# EAGLE schematic PowerBoard (EAGLE 6.1)
AUTHOR: Sandor Szilvasi; AUTHOREMAIL: sandor.szilvasi@vanderbilt.edu; COPYRIGHT: Copyright © 2011 Vanderbilt University, ISIS; PAGE1: Cover Page; PAGE2: Power Supply; PAGE3: Current Monitor; PAGE4: Misc; PAGE5: Connector; REVIEWER: Benjamin Babjak; REVIEWEREMAIL: benjamin.babjak@vanderbilt.edu; REVISION: B; TITLE: Yellowstone

## Sheet 1 of 5
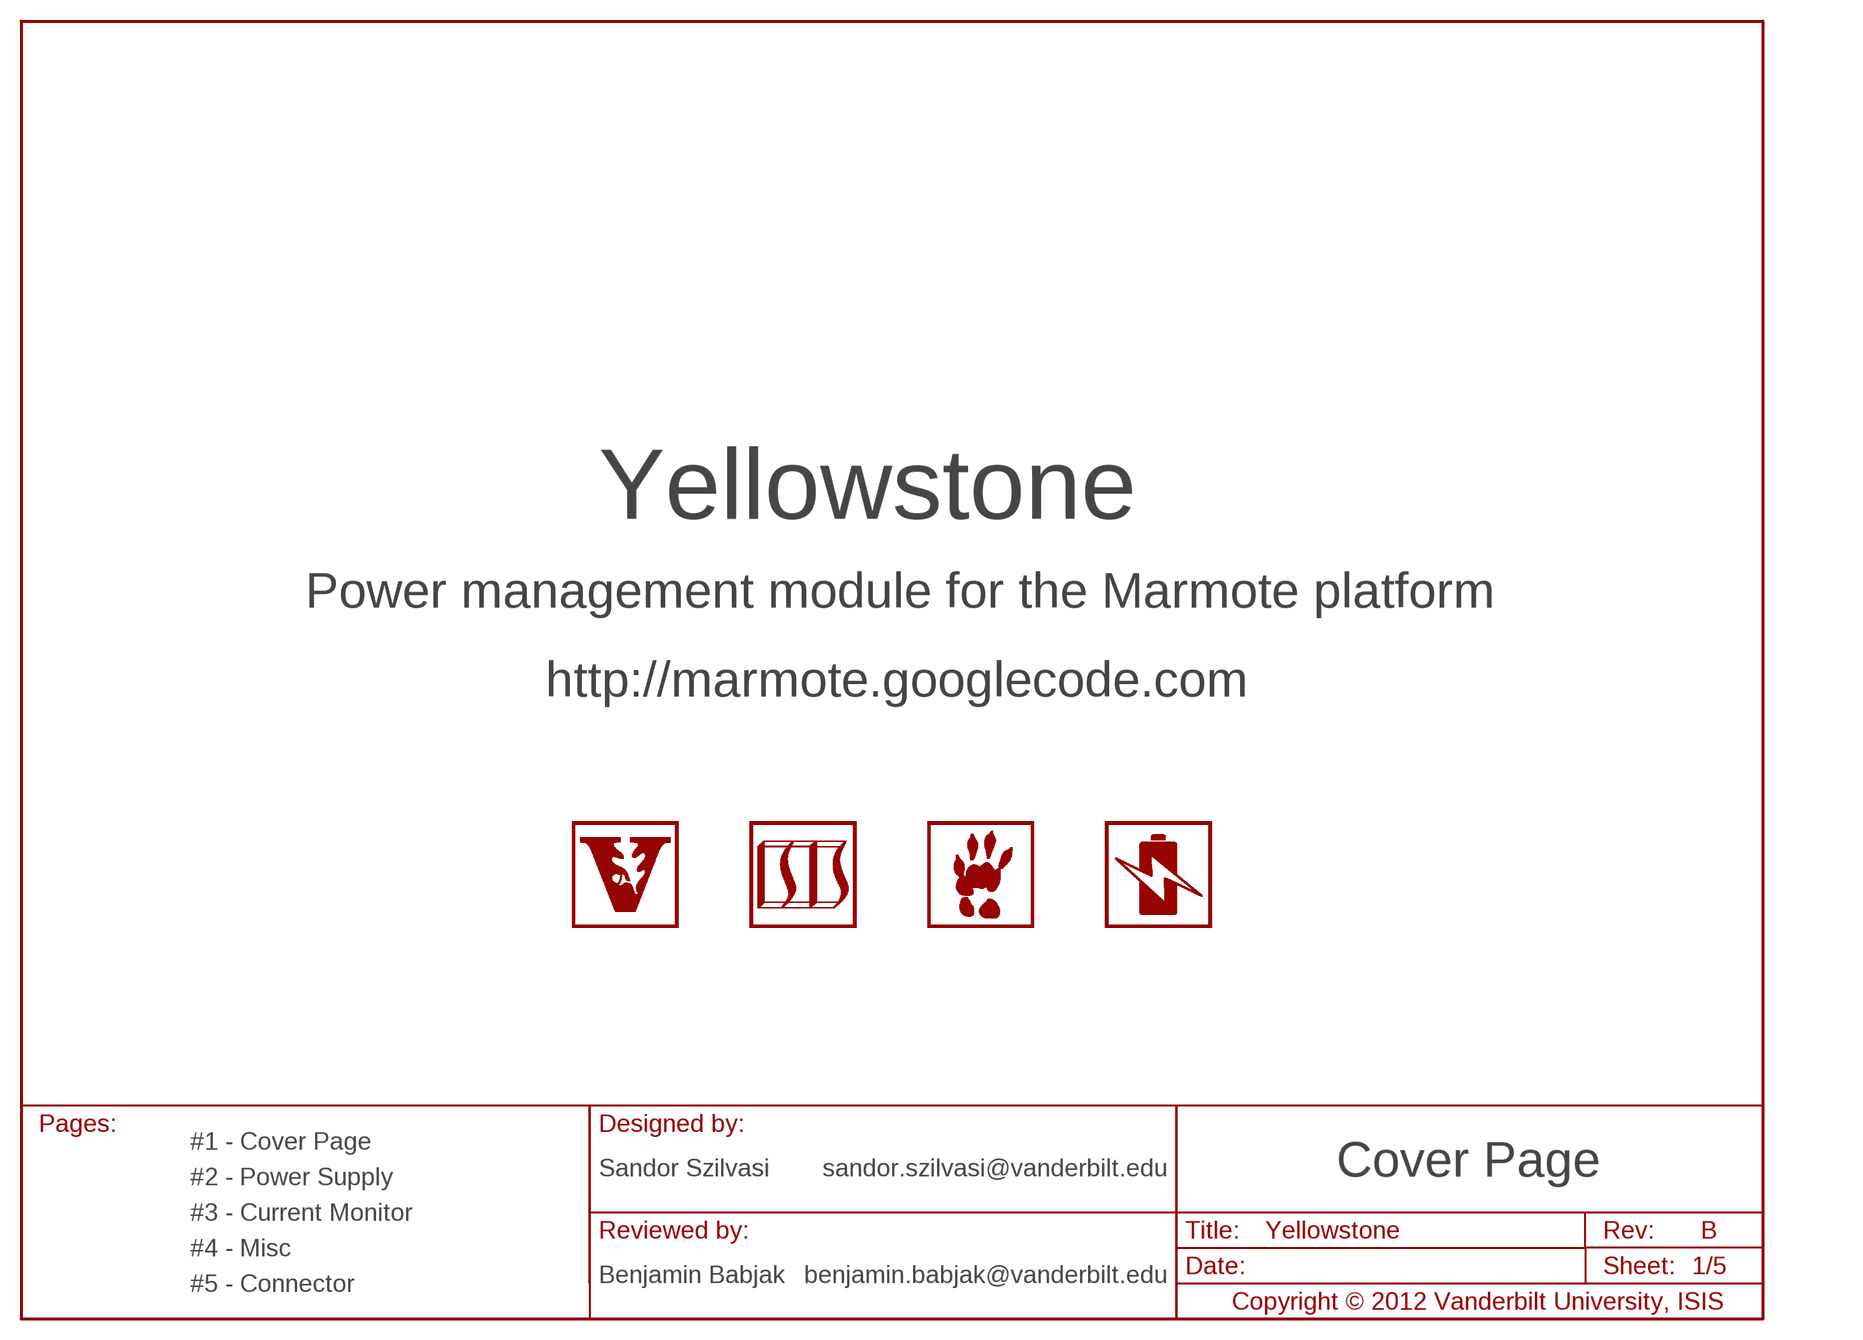
[diagram p0: schematic, sheet 1]

### Parts
LOGO1  LOGO-ISIS-600MIL-10MM-SS  [LOGO-ISIS-10MM-SILKSCREEN]
LOGO2  LOGO-BATTERY-600MIL-10MM-SS  [LOGO-BATTERY-10MM-SILKSCREEN]
LOGO5  LOGO-VANDERBILT-600MIL-10MM-SS  [LOGO-VANDERBILT-10MM-SILKSCREEN]
LOGO6  LOGO-MARMOTE-600MIL-10MM-SS  [LOGO-MARMOTE-10MM-SILKSCREEN]

### Notes on the sheet
- Power management module for the Marmote platform
- http://marmote.googlecode.com

## Sheet 2 of 5
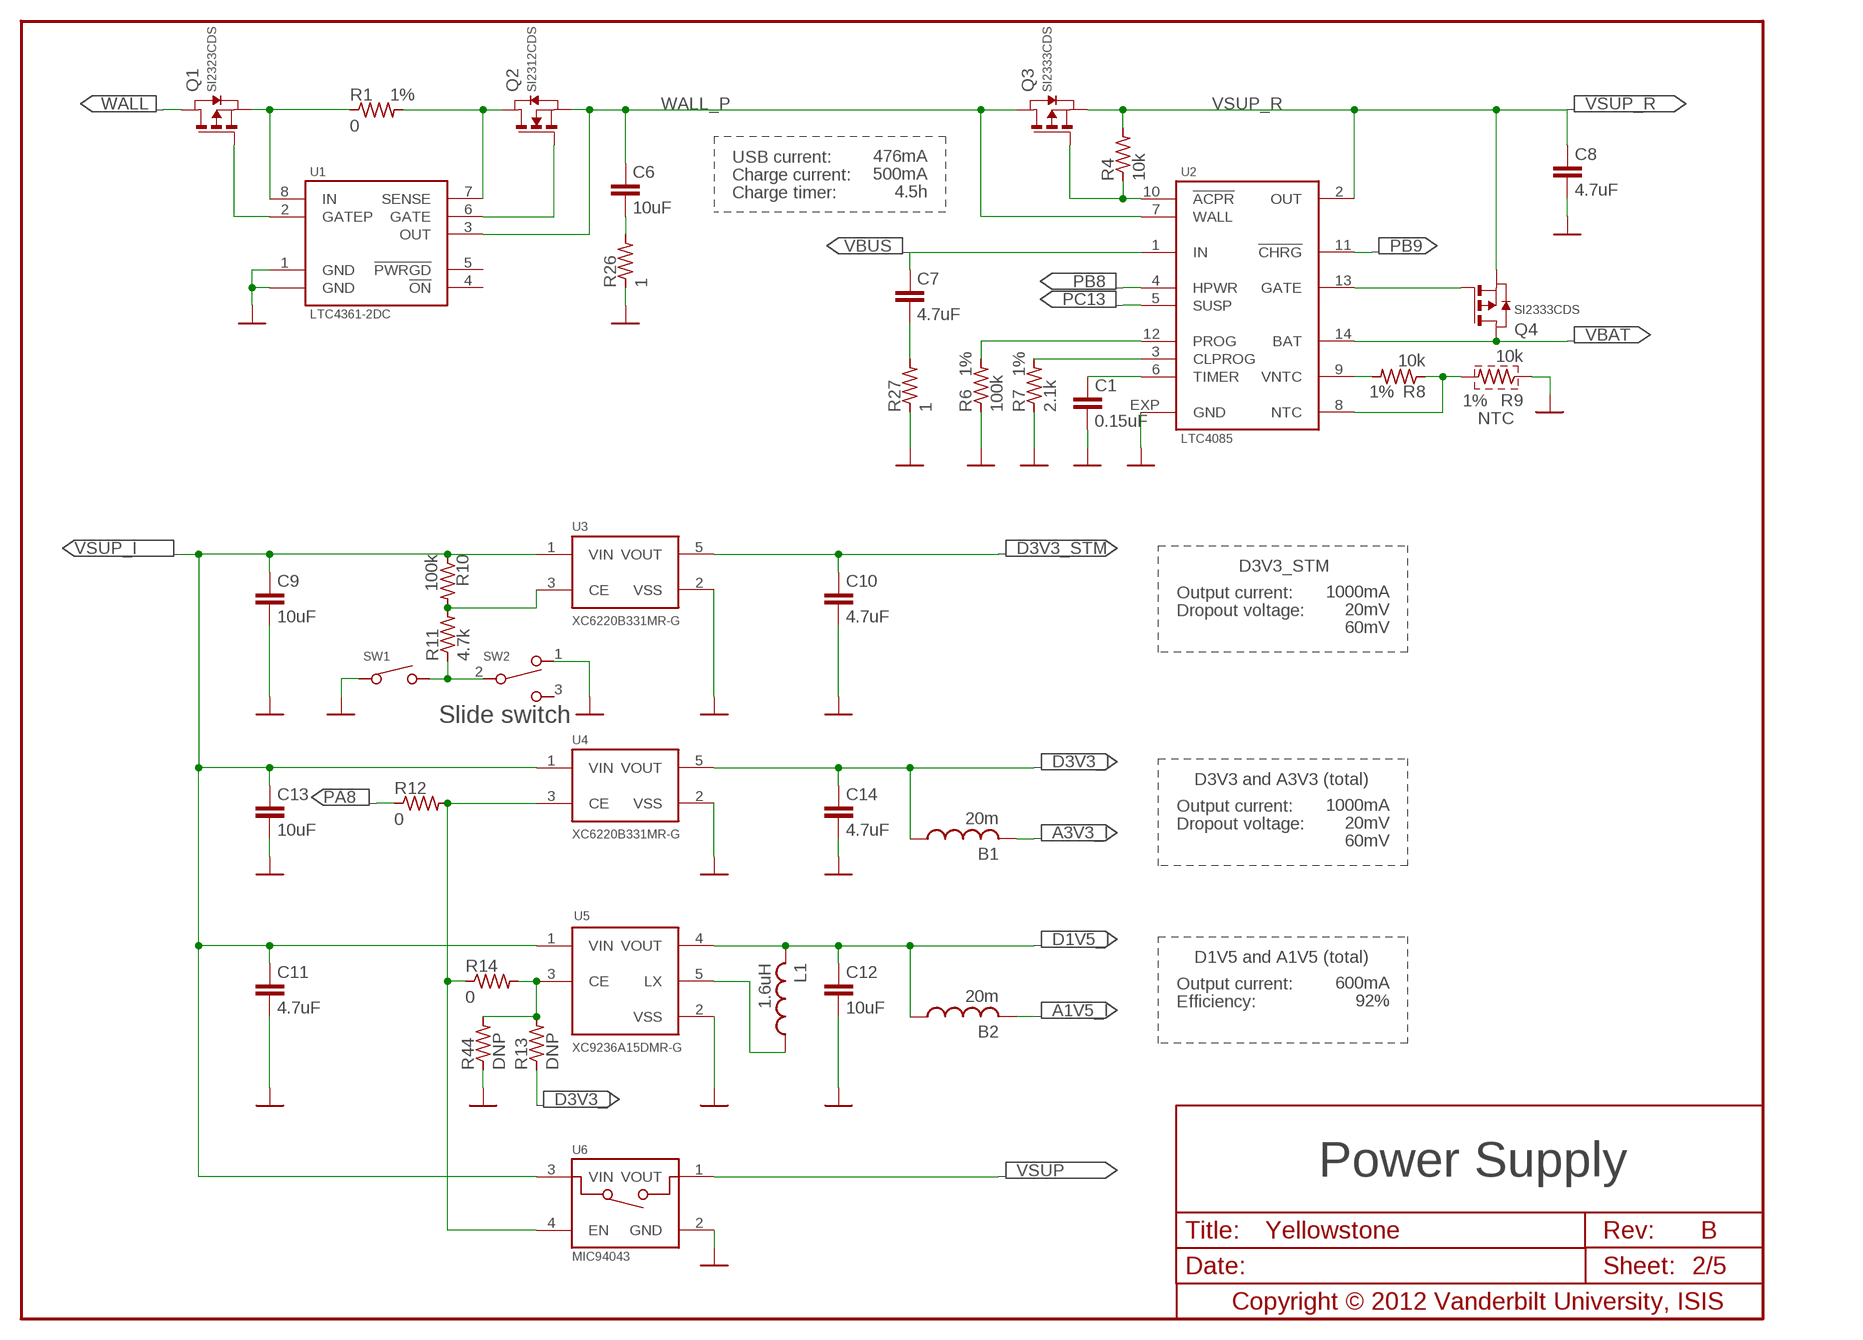
[diagram p1: schematic, sheet 2]

### Parts
B1  20m  BEAD0603  [L0603]
B2  20m  BEAD0603  [L0603]
C1  0.15uF  C0603  [C0603]
C6  10uF  C0603  [C0603]
C7  4.7uF  C0603  [C0603]
C8  4.7uF  C0603  [C0603]
C9  10uF  C0603  [C0603]
C10  4.7uF  C0603  [C0603]
C11  4.7uF  C0603  [C0603]
C12  10uF  C0603  [C0603]
C13  10uF  C0603  [C0603]
C14  4.7uF  C0603  [C0603]
L1  1.6uH  L-VLCF4018T  [4X4MM]
Q1  SI2323CDS  [SOT23-3L]
Q2  SI2312CDS  [SOT23-3L]
Q3  SI2333CDS  [SOT23-3L]
Q4  SI2333CDS  [SOT23-3L]
R1  0  R0603  [R0603]
R4  10k  R0603  [R0603]
R6  100k  R0603  [R0603]
R7  2.1k  R0603  [R0603]
R8  10k  R0603  [R0603]
R9  10k  NTCG06  [R0603]
R10  100k  R0603  [R0603]
R11  4.7k  R0603  [R0603]
R12  0  R0603  [R0603]
R13  DNP  R0603  [R0603]
R14  0  R0603  [R0603]
R26  1  R0603  [R0603]
R27  1  R0603  [R0603]
R44  DNP  R0603  [R0603]
SW1  SWITCH-SPST  SWITCH-SPST-JST  [S2B-PH-SM4-TB]
SW2  SWITCH-MS12ASG30  [MS12ASX30]
U1  LTC4361-2DC  [DFN-8]
U2  LTC4085  [DFN-14]
U3  XC6220B331MR-G  [SOT25]
U4  XC6220B331MR-G  [SOT25]
U5  XC9236A15DMR-G  [SOT25]
U6  MIC94043  [MLF-4]

### Nets
!ACPR: Q3.1(G) R4.1 U2.10(!ACPR)
A1V5_I: B2.2 ; also sheet 3
A3V3_I: B1.2 ; also sheet 3
CLPROG: R7.2 U2.3(CLPROG)
D1V5-EN: R13.2 R14.2 R44.2 U5.3(CE)
D1V5_I: B2.1 C12.1 L1.2 U5.4(VOUT) ; also sheet 3
D3V3_I: B1.1 C14.1 R13.1 U4.5(VOUT) ; also sheet 3
D3V3_STM: C10.1 U3.5(VOUT) ; also sheet 3,4,5
D3V3_STM-EN: R10.2 R11.2 U3.3(CE)
D3V3_STM-EN-SW: R11.1 SW1.2(1A) SW2.2
DGND: C1.2 C8.2 C9.2 C10.2 C11.2 C12.2 C13.2 C14.2 R6.1 R7.1 R9.2 R26.1 R27.1 R44.1 SW1.1 SW2.1 U1.1(GND) U1.EXP(GND) U2.EXP(GND) U3.2(VSS) U4.2(VSS) U5.2(VSS) U6.2(GND) ; also sheet 3,4,5
GATE1: Q2.1(G) U1.6(GATE)
GATE2: Q4.1(G) U2.13(GATE)
GATEP: Q1.1(G) U1.2(GATEP)
IN: Q1.2(S) R1.1 U1.8(IN)
N$1: C7.2 R27.2
N$3: C6.2 R26.2
N$5: L1.1 U5.5(LX)
N$15: Q2.3(D) R1.2 U1.7(SENSE)
NTC: R8.1 R9.1 U2.8(NTC)
PA8: R12.1 ; also sheet 3,4
PA8-EN: R12.2 R14.1 U4.3(CE) U6.4(EN) ; also sheet 4
PB8: U2.4(HPWR) ; also sheet 3,4
PB9: U2.11(!CHRG) ; also sheet 3,4
PC13: U2.5(SUSP) ; also sheet 3,4
PROG: R6.2 U2.12(PROG)
TIMER: C1.1 U2.6(TIMER)
VBAT: Q4.3(D) U2.14(BAT) ; also sheet 3,4
VBUS: C7.1 U2.1(IN) ; also sheet 4,5
VNTC: R8.2 U2.9(VNTC)
VSUP: U6.1(VOUT) ; also sheet 4,5
VSUP_I: C9.1 C11.1 C13.1 R10.1 U3.1(VIN) U4.1(VIN) U5.1(VIN) U6.3(VIN) ; also sheet 3
VSUP_R: C8.1 Q3.2(S) Q4.2(S) R4.2 U2.2(OUT) ; also sheet 3,4
WALL: Q1.3(D) ; also sheet 4,5
WALL_P: C6.1 Q2.2(S) Q3.3(D) U1.3(OUT) U2.7(WALL)
Unconnected: SW2.3 U1.4(!ON) U1.5(!PWRGD) U3.4(NC) U4.4(NC)

### Notes on the sheet
- 476mA
- USB current: | 500mA
- Charge current: | 4.5h
- Charge timer:
- D3V3_STM
- 1000mA
- Output current: | 20mV
- Dropout voltage: | 60mV
- Slide switch
- D3V3 and A3V3 (total)
- 1000mA
- Output current: | 20mV
- Dropout voltage: | 60mV
- D1V5 and A1V5 (total)
- 600mA
- Output current: | 92%
- Efficiency:

## Sheet 3 of 5
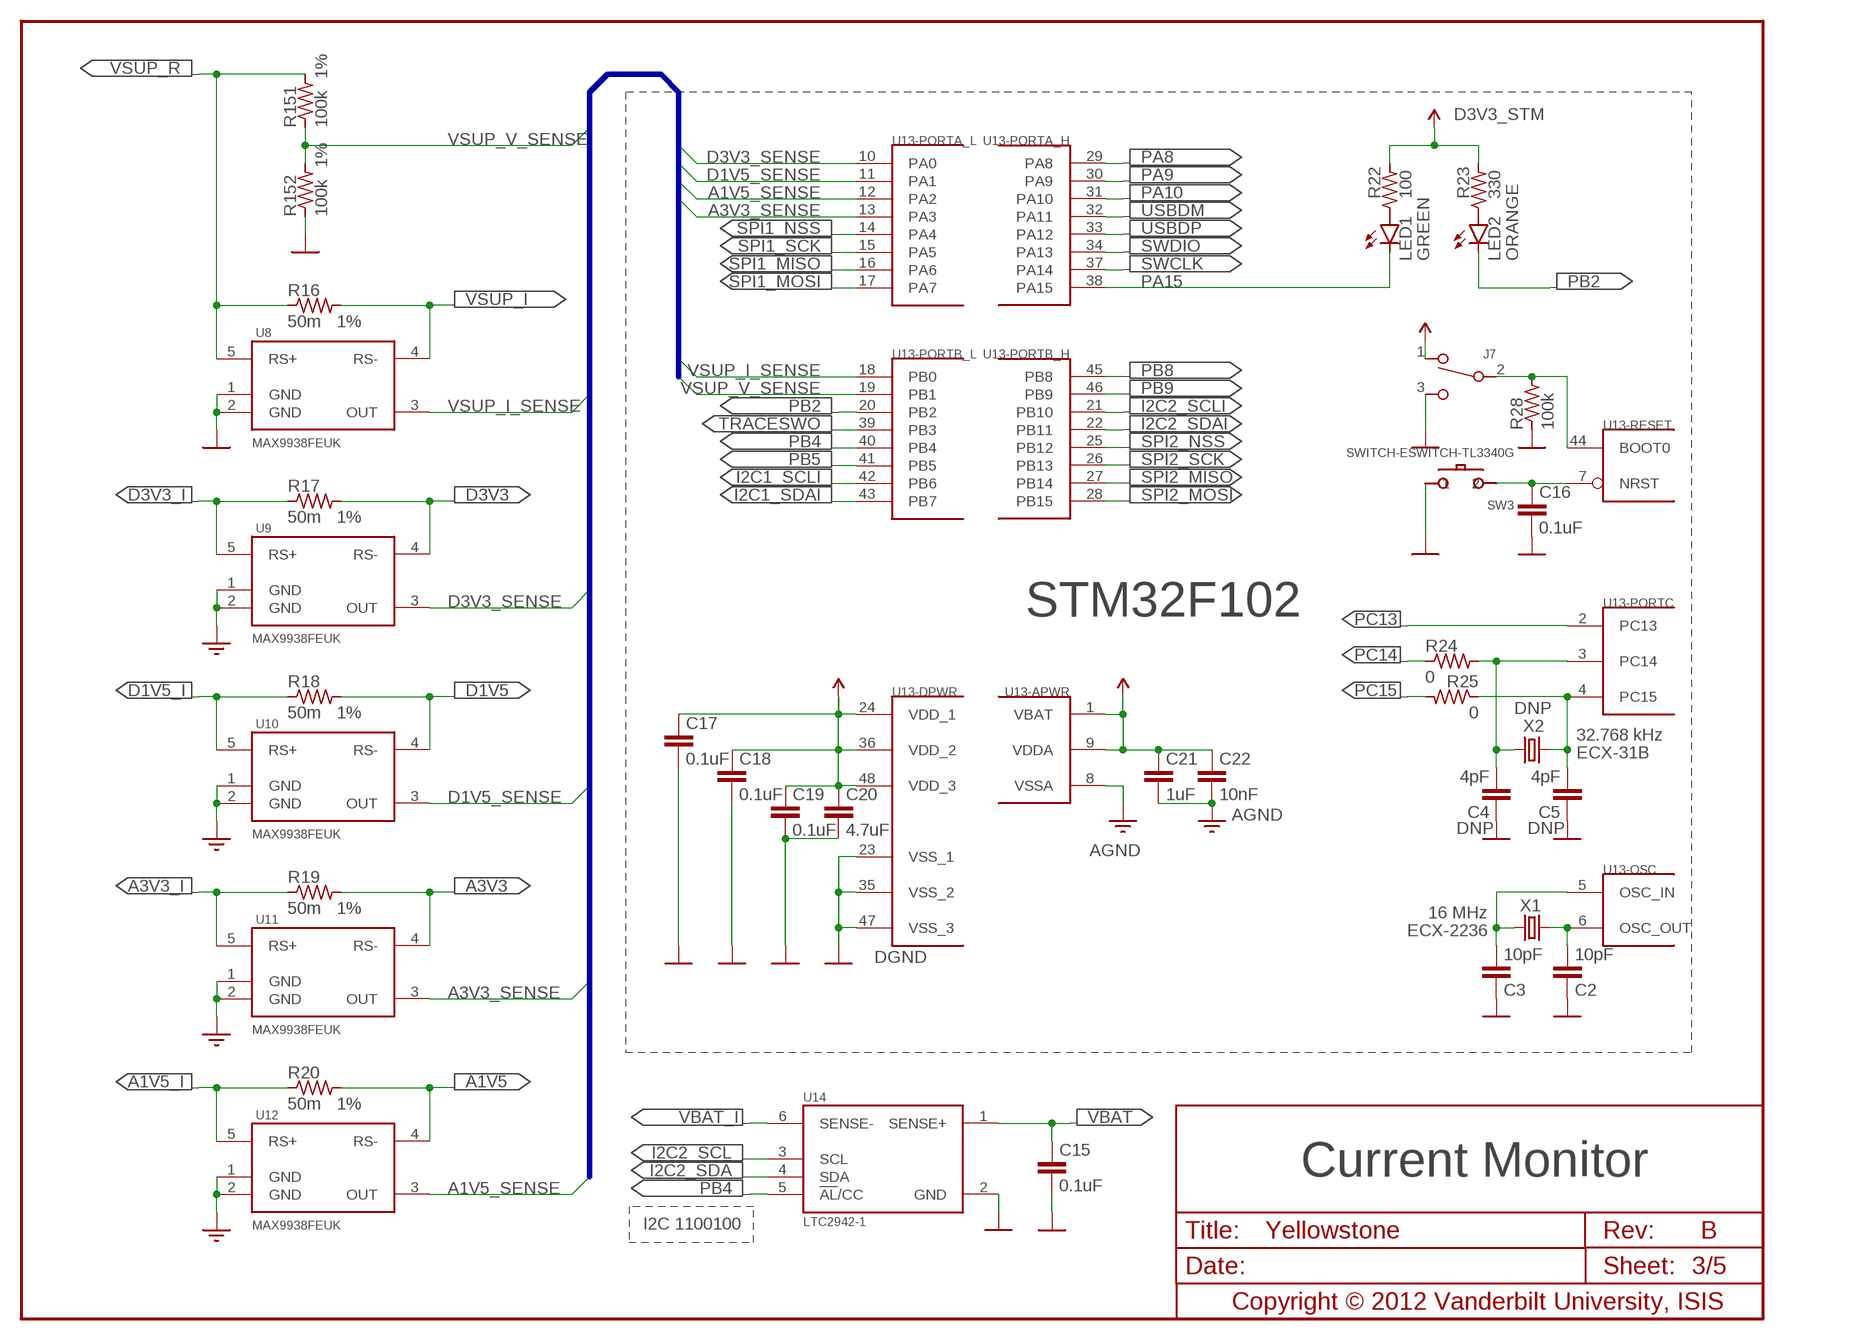
[diagram p2: schematic, sheet 3]

### Parts
C2  10pF  C0603  [C0603]
C3  10pF  C0603  [C0603]
C4  4pF  C0603  [C0603]
C5  4pF  C0603  [C0603]
C15  0.1uF  C0603  [C0603]
C16  0.1uF  C0603  [C0603]
C17  0.1uF  C0603  [C0603]
C18  0.1uF  C0603  [C0603]
C19  0.1uF  C0603  [C0603]
C20  4.7uF  C0603  [C0603]
C21  1uF  C0603  [C0603]
C22  10nF  C0603  [C0603]
J7  SWITCH-CJS-1200-1200  [SWITCH-DIP-CJS]
LED1  GREEN  LED-MGC-3010  [LED1208-RA]
LED2  ORANGE  LED-ECK-3010  [LED1208-RA]
R16  50m  R0603  [R0603]
R17  50m  R0603  [R0603]
R18  50m  R0603  [R0603]
R19  50m  R0603  [R0603]
R20  50m  R0603  [R0603]
R22  100  R0603  [R0603]
R23  330  R0603  [R0603]
R24  0  R0603  [R0603]
R25  0  R0603  [R0603]
R28  100k  R0603  [R0603]
R151  100k  R0603  [R0603]
R152  100k  R0603  [R0603]
SW3  SWITCH-ESWITCH-TL3340G  [TL3340]
U8  MAX9938FEUK  [SOT23-5L]
U9  MAX9938FEUK  [SOT23-5L]
U10  MAX9938FEUK  [SOT23-5L]
U11  MAX9938FEUK  [SOT23-5L]
U12  MAX9938FEUK  [SOT23-5L]
U13  STM32F10XCXT6  [TQFP-48]
U14  LTC2942-1  [DFN-6]
X1  ECX-2236  [ECX-2236]
X2  ECX-31B  [ECX-31B]

### Nets
A1V5: R20.2 U12.4(RS-) ; also sheet 4,5
A1V5_I: R20.1 U12.5(RS+) ; also sheet 2
A1V5_SENSE: U12.3(OUT) U13.12(-PORTA_L:PA2)
A3V3: R19.2 U11.4(RS-) ; also sheet 4,5
A3V3_I: R19.1 U11.5(RS+) ; also sheet 2
A3V3_SENSE: U11.3(OUT) U13.13(-PORTA_L:PA3)
AGND: C21.2 C22.2 U9.1(GND) U9.2(GND) U10.1(GND) U10.2(GND) U11.1(GND) U11.2(GND) U12.1(GND) U12.2(GND) U13.8(-APWR:VSSA) ; also sheet 4,5
BOOT0: J7.2 R28.2 U13.44(-RESET:BOOT0)
D1V5: R18.2 U10.4(RS-) ; also sheet 4,5
D1V5_I: R18.1 U10.5(RS+) ; also sheet 2
D1V5_SENSE: U10.3(OUT) U13.11(-PORTA_L:PA1)
D3V3: R17.2 U9.4(RS-) ; also sheet 4,5
D3V3_I: R17.1 U9.5(RS+) ; also sheet 2
D3V3_SENSE: U9.3(OUT) U13.10(-PORTA_L:PA0)
D3V3_STM: C17.1 C18.1 C19.1 C20.1 C21.1 C22.1 J7.1 R22.2 R23.2 U13.1(-APWR:VBAT) U13.9(-APWR:VDDA) U13.24(-DPWR:VDD_1) U13.36(-DPWR:VDD_2) U13.48(-DPWR:VDD_3) ; also sheet 2,4,5
DGND: C2.1 C3.1 C4.1 C5.1 C15.2 C16.2 C17.2 C18.2 C19.2 C20.2 J7.3 R28.1 R152.1 SW3.1 SW3.3 U8.1(GND) U8.2(GND) U13.23(-DPWR:VSS_1) U13.35(-DPWR:VSS_2) U13.47(-DPWR:VSS_3) U14.2(GND) ; also sheet 2,4,5
I2C1_SCLI: U13.42(-PORTB_L:PB6) ; also sheet 4
I2C1_SDAI: U13.43(-PORTB_L:PB7) ; also sheet 4
I2C2_SCL: U14.3(SCL) ; also sheet 4
I2C2_SCLI: U13.21(-PORTB_H:PB10) ; also sheet 4
I2C2_SDA: U14.4(SDA) ; also sheet 4
I2C2_SDAI: U13.22(-PORTB_H:PB11) ; also sheet 4
N$25: LED2.2(A) R23.1
N$29: LED1.2(A) R22.1
NRST: C16.1 SW3.2 U13.7(-RESET:NRST)
OSC_IN: C3.2 U13.5(-OSC:OSC_IN) X1.3
OSC_OUT: C2.2 U13.6(-OSC:OSC_OUT) X1.1
PA8: U13.29(-PORTA_H:PA8) ; also sheet 2,4
PA9: U13.30(-PORTA_H:PA9) ; also sheet 5
PA10: U13.31(-PORTA_H:PA10) ; also sheet 5
PA15: LED1.1(C) U13.38(-PORTA_H:PA15)
PB2: LED2.1(C) U13.20(-PORTB_L:PB2) ; also sheet 4
PB4: U13.40(-PORTB_L:PB4) U14.5(!AL!/CC) ; also sheet 4
PB5: U13.41(-PORTB_L:PB5) ; also sheet 5
PB8: U13.45(-PORTB_H:PB8) ; also sheet 2,4
PB9: U13.46(-PORTB_H:PB9) ; also sheet 2,4
PC13: U13.2(-PORTC:PC13) ; also sheet 2,4
PC14: R24.1 ; also sheet 5
PC14-S: C4.2 R24.2 U13.3(-PORTC:PC14) X2.2
PC15: R25.2 ; also sheet 5
PC15-S: C5.2 R25.1 U13.4(-PORTC:PC15) X2.1
SPI1_MISO: U13.16(-PORTA_L:PA6) ; also sheet 5
SPI1_MOSI: U13.17(-PORTA_L:PA7) ; also sheet 5
SPI1_NSS: U13.14(-PORTA_L:PA4) ; also sheet 4,5
SPI1_SCK: U13.15(-PORTA_L:PA5) ; also sheet 5
SPI2_MISO: U13.27(-PORTB_H:PB14) ; also sheet 5
SPI2_MOSI: U13.28(-PORTB_H:PB15) ; also sheet 5
SPI2_NSS: U13.25(-PORTB_H:PB12) ; also sheet 4,5
SPI2_SCK: U13.26(-PORTB_H:PB13) ; also sheet 5
SWCLK: U13.37(-PORTA_H:PA14) ; also sheet 5
SWDIO: U13.34(-PORTA_H:PA13) ; also sheet 5
TRACESWO: U13.39(-PORTB_L:PB3) ; also sheet 5
USBDM: U13.32(-PORTA_H:PA11) ; also sheet 5
USBDP: U13.33(-PORTA_H:PA12) ; also sheet 5
VBAT: C15.1 U14.1(SENSE+) ; also sheet 2,4
VBAT_I: U14.6(SENSE-) ; also sheet 5
VSUP_I: R16.2 U8.4(RS-) ; also sheet 2
VSUP_I_SENSE: U8.3(OUT) U13.18(-PORTB_L:PB0)
VSUP_R: R16.1 R151.2 U8.5(RS+) ; also sheet 2,4
VSUP_V_SENSE: R151.1 R152.2 U13.19(-PORTB_L:PB1)

### Buses
D3V3_STM_SENSE,VSUP_SENSE,D3V3_SENSE,D1V5_SENSE,A3V3_SENSE,A1V5_SENSE

### Notes on the sheet
- STM32F102
- 32.768 kHz
- 16 MHz
- I2C 1100100

## Sheet 4 of 5
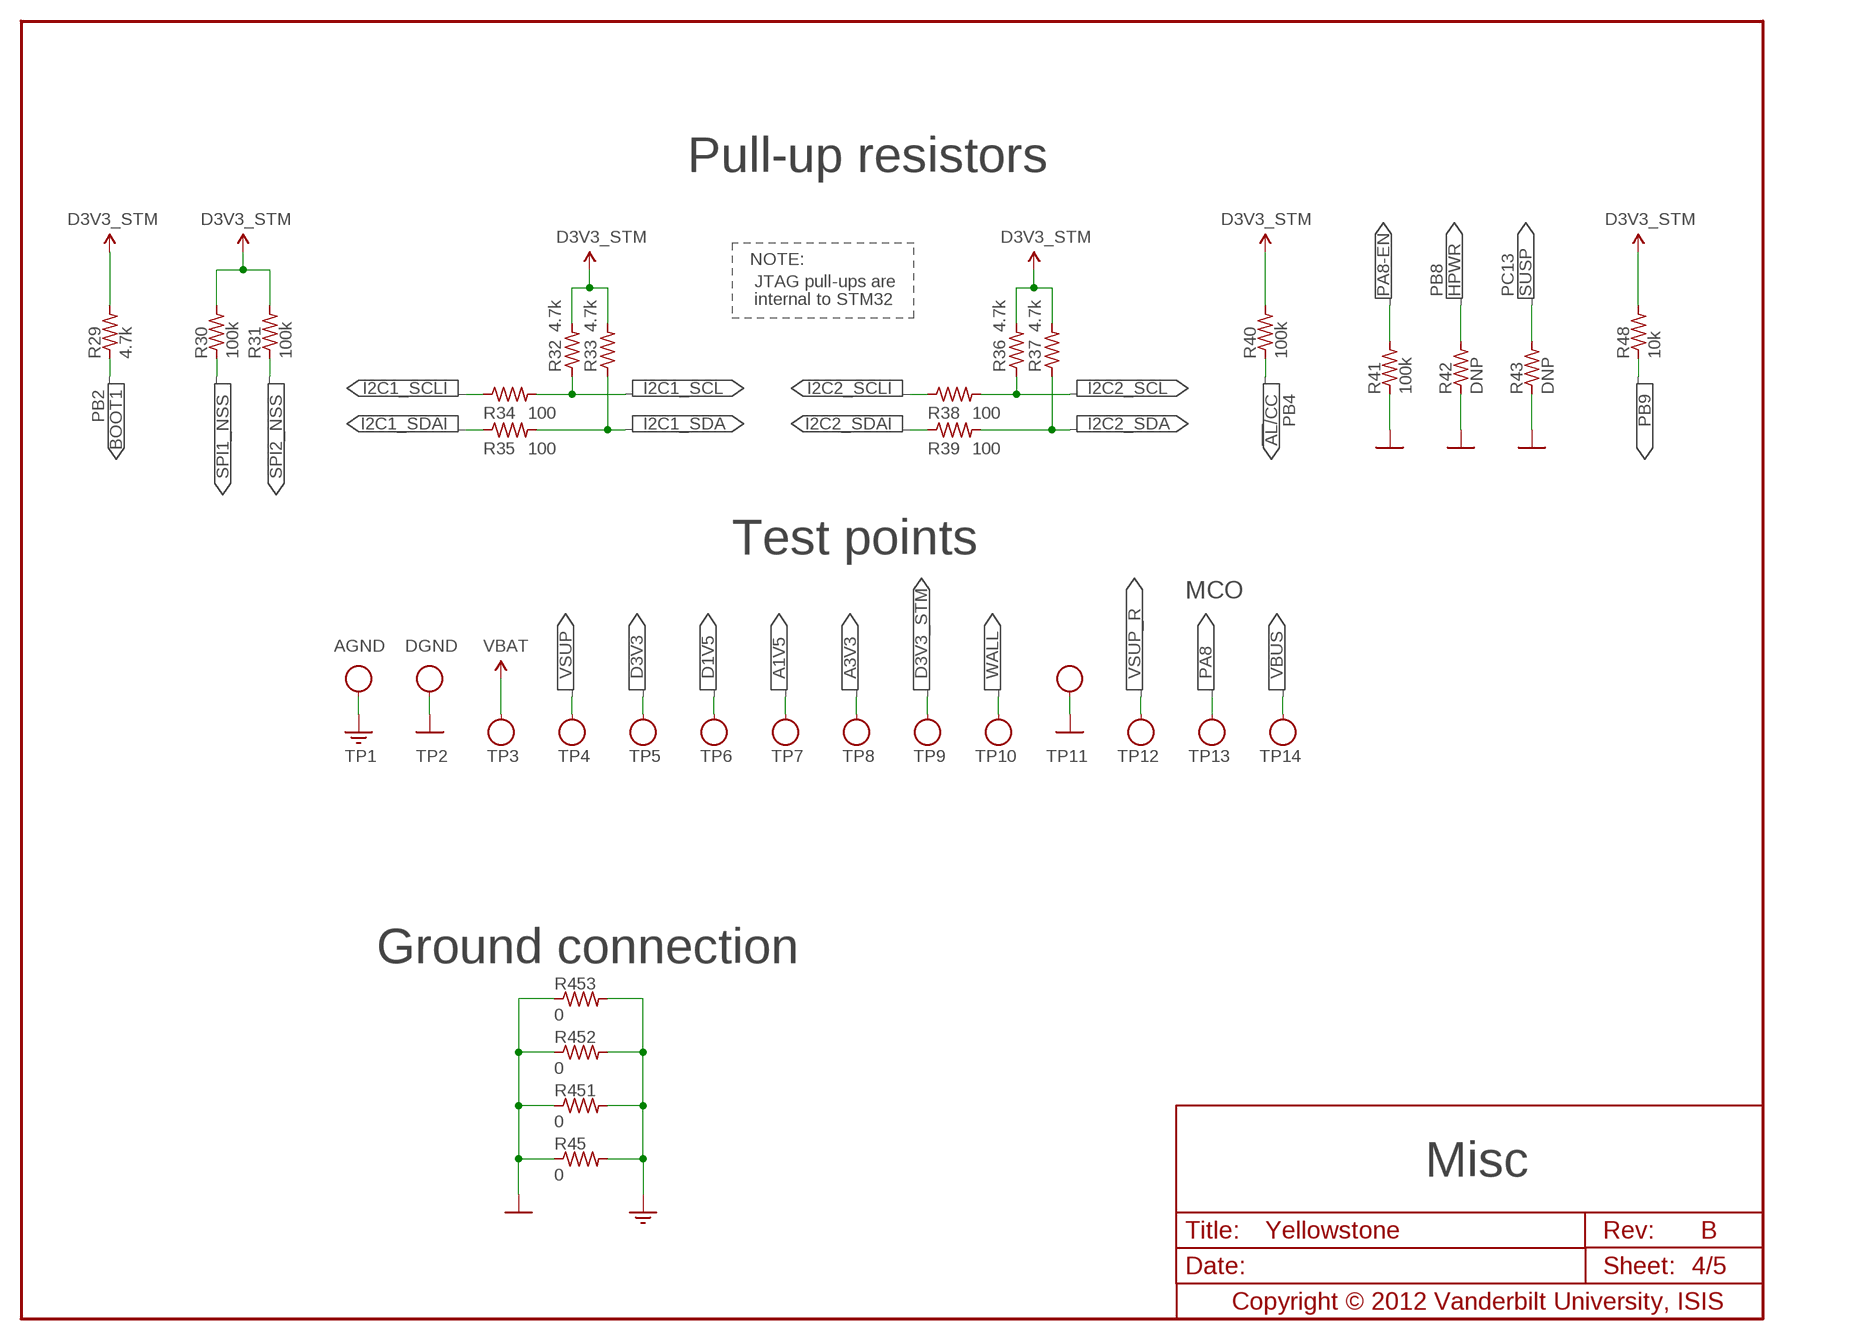
[diagram p3: schematic, sheet 4]

### Parts
R29  4.7k  R0603  [R0603]
R30  100k  R0603  [R0603]
R31  100k  R0603  [R0603]
R32  4.7k  R0603  [R0603]
R33  4.7k  R0603  [R0603]
R34  100  R0603  [R0603]
R35  100  R0603  [R0603]
R36  4.7k  R0603  [R0603]
R37  4.7k  R0603  [R0603]
R38  100  R0603  [R0603]
R39  100  R0603  [R0603]
R40  100k  R0603  [R0603]
R41  100k  R0603  [R0603]
R42  DNP  R0603  [R0603]
R43  DNP  R0603  [R0603]
R45  0  R0603  [R0603]
R48  10k  R0603  [R0603]
R451  0  R0603  [R0603]
R452  0  R0603  [R0603]
R453  0  R0603  [R0603]
TP1  TESTPOINT  TESTPOINT-YELLOW  [TESTPOINT]
TP2  TESTPOINT  TESTPOINT-YELLOW  [TESTPOINT]
TP3  TESTPOINT  TESTPOINT-BLUE  [TESTPOINT]
TP4  TESTPOINT  TESTPOINT-BLUE  [TESTPOINT]
TP5  TESTPOINT  TESTPOINT-BLUE  [TESTPOINT]
TP6  TESTPOINT  TESTPOINT-BLUE  [TESTPOINT]
TP7  TESTPOINT  TESTPOINT-GREEN  [TESTPOINT]
TP8  TESTPOINT  TESTPOINT-GREEN  [TESTPOINT]
TP9  TESTPOINT  TESTPOINT-BLUE  [TESTPOINT]
TP10  TESTPOINT  TESTPOINT-BLUE  [TESTPOINT]
TP11  TESTPOINT  TESTPOINT-YELLOW  [TESTPOINT]
TP12  TESTPOINT  TESTPOINT-BLUE  [TESTPOINT]
TP13  TESTPOINT  TESTPOINT-RED  [TESTPOINT]
TP14  TESTPOINT  TESTPOINT-BLUE  [TESTPOINT]

### Nets
A1V5: TP7.1 ; also sheet 3,5
A3V3: TP8.1 ; also sheet 3,5
AGND: R45.2 R451.2 R452.2 R453.2 TP1.1 ; also sheet 3,5
D1V5: TP6.1 ; also sheet 3,5
D3V3: TP5.1 ; also sheet 3,5
D3V3_STM: R29.2 R30.2 R31.2 R32.2 R33.2 R36.2 R37.2 R40.2 R48.2 TP9.1 ; also sheet 2,3,5
DGND: R41.1 R42.1 R43.1 R45.1 R451.1 R452.1 R453.1 TP2.1 TP11.1 ; also sheet 2,3,5
I2C1_SCL: R32.1 R34.2 ; also sheet 5
I2C1_SCLI: R34.1 ; also sheet 3
I2C1_SDA: R33.1 R35.2 ; also sheet 5
I2C1_SDAI: R35.1 ; also sheet 3
I2C2_SCL: R36.1 R38.2 ; also sheet 3
I2C2_SCLI: R38.1 ; also sheet 3
I2C2_SDA: R37.1 R39.2 ; also sheet 3
I2C2_SDAI: R39.1 ; also sheet 3
PA8: TP13.1 ; also sheet 2,3
PA8-EN: R41.2 ; also sheet 2
PB2: R29.1 ; also sheet 3
PB4: R40.1 ; also sheet 3
PB8: R42.2 ; also sheet 2,3
PB9: R48.1 ; also sheet 2,3
PC13: R43.2 ; also sheet 2,3
SPI1_NSS: R30.1 ; also sheet 3,5
SPI2_NSS: R31.1 ; also sheet 3,5
VBAT: TP3.1 ; also sheet 2,3
VBUS: TP14.1 ; also sheet 2,5
VSUP: TP4.1 ; also sheet 2,5
VSUP_R: TP12.1 ; also sheet 2,3
WALL: TP10.1 ; also sheet 2,5

### Notes on the sheet
- Pull-up resistors
- NOTE:
- JTAG pull-ups are
- HPWR | SUSP
- internal to STM32
- BOOT1 | !AL!/CC
- Test points
- MCO
- Ground connection

## Sheet 5 of 5
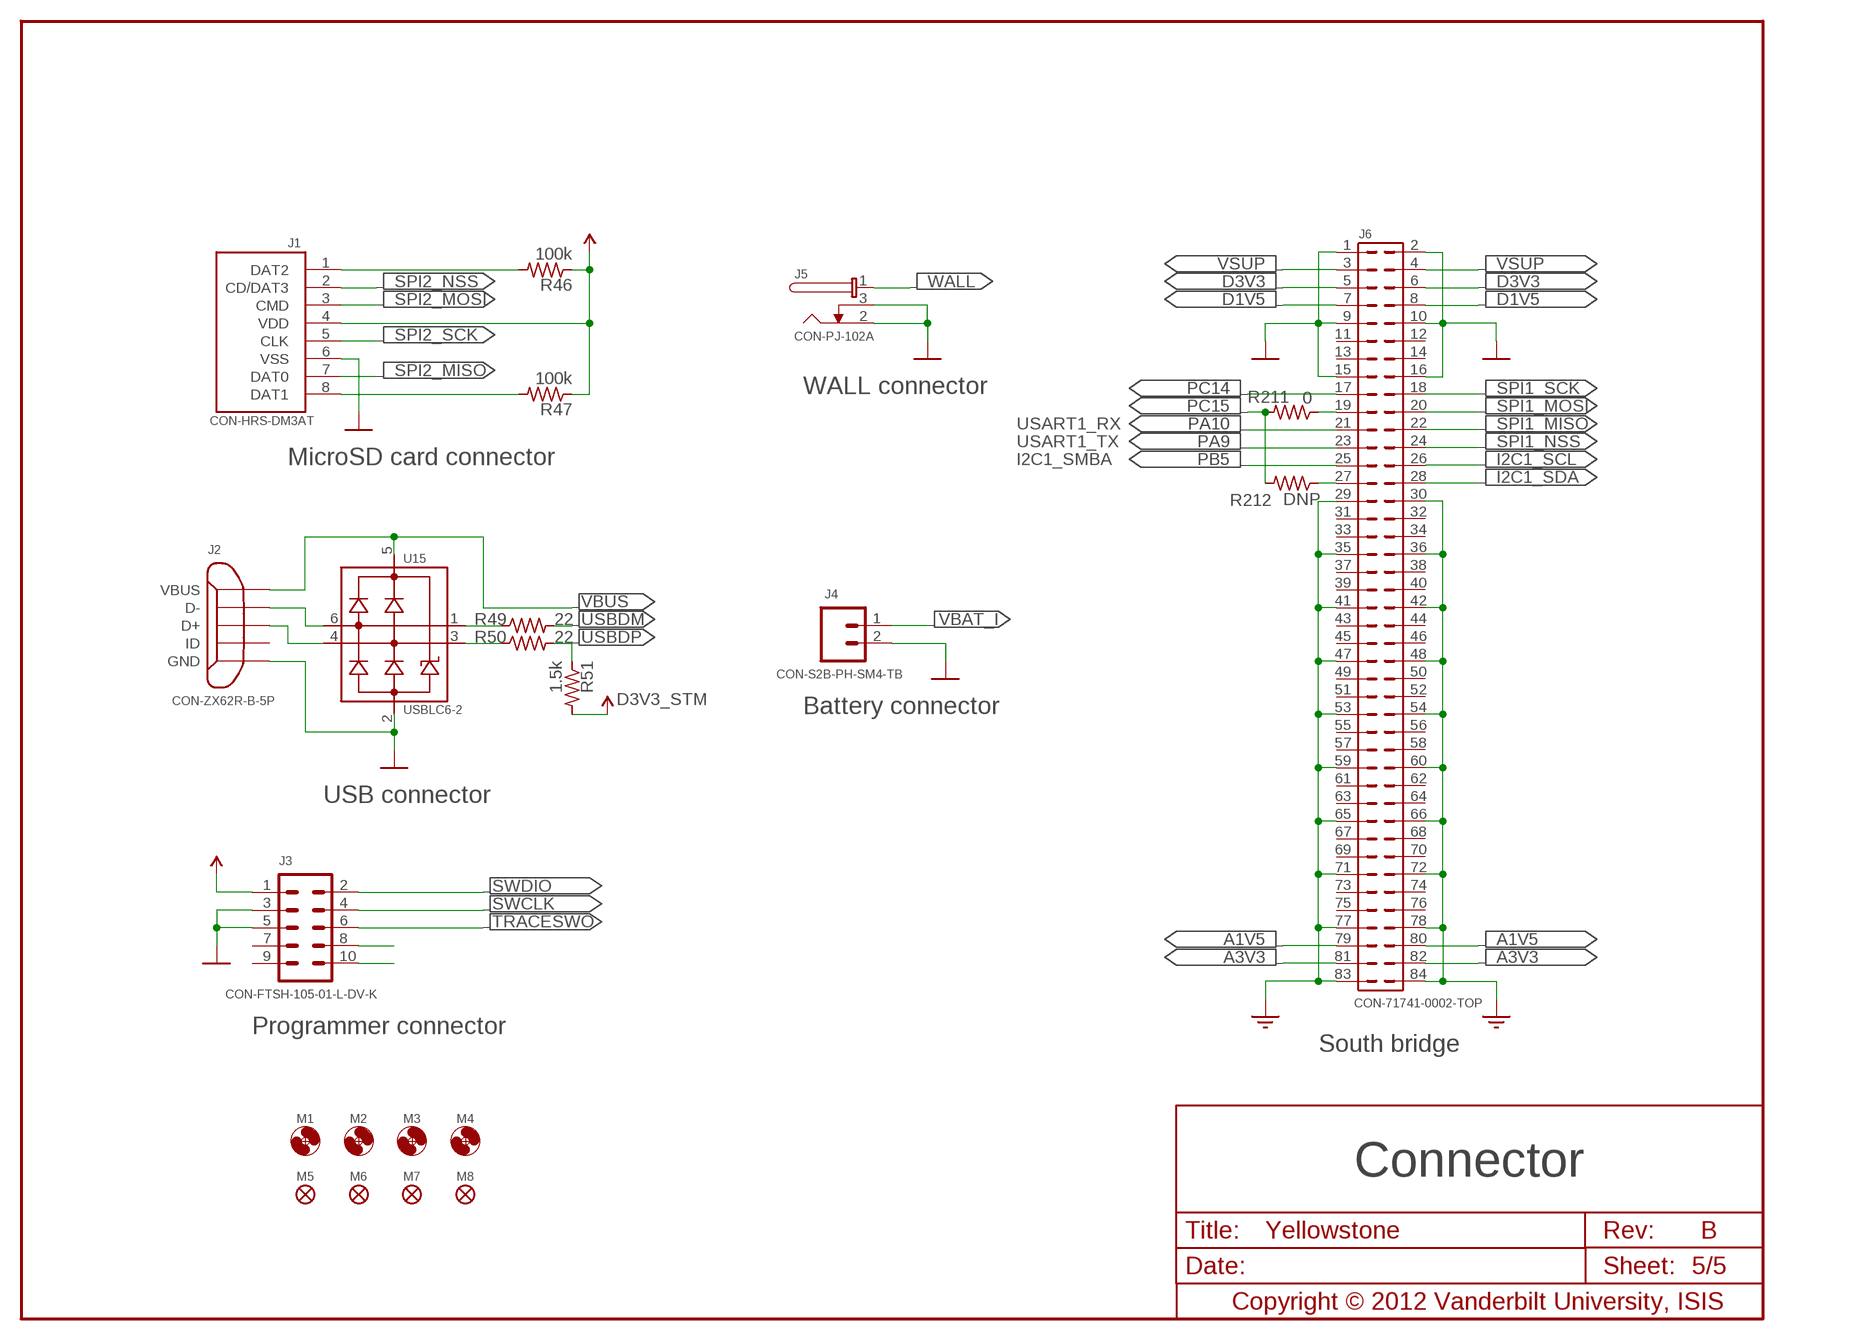
[diagram p4: schematic, sheet 5]

### Parts
J1  CON-HRS-DM3AT  [HRS-DM3AT]
J2  CON-ZX62R-B-5P  [ZX62R-B-5P]
J3  CON-FTSH-105-01-L-DV-K  [FTSH-105-01-L-DV-K]
J4  CON-S2B-PH-SM4-TB  [S2B-PH-SM4-TB]
J5  CON-PJ-102A  [PJ-102A]
J6  CON-71741-0002-TOP  [71741-0002]
M1  MOUNT-HOLE3.3  [3,3]
M2  MOUNT-HOLE3.3  [3,3]
M3  MOUNT-HOLE3.3  [3,3]
M4  MOUNT-HOLE3.3  [3,3]
M5  FIDUCIAL1X2  [FIDUCIAL-1X2]
M6  FIDUCIAL1X2  [FIDUCIAL-1X2]
M7  FIDUCIAL1X2  [FIDUCIAL-1X2]
M8  FIDUCIAL1X2  [FIDUCIAL-1X2]
R46  100k  R0603  [R0603]
R47  100k  R0603  [R0603]
R49  22  R0603  [R0603]
R50  22  R0603  [R0603]
R51  1.5k  R0603  [R0603]
R211  0  R0603  [R0603]
R212  DNP  R0603  [R0603]
U15  USBLC6-2  USBLC6-2SC6  [SOT23-6L]

### Nets
A1V5: J6.79 J6.80 ; also sheet 3,4
A3V3: J6.81 J6.82 ; also sheet 3,4
AGND: J6.29 J6.30 J6.35 J6.36 J6.41 J6.42 J6.47 J6.48 J6.53 J6.54 J6.59 J6.60 J6.65 J6.66 J6.71 J6.72 J6.77 J6.78 J6.83 J6.84 ; also sheet 3,4
D1V5: J6.7 J6.8 ; also sheet 3,4
D3V3: J6.5 J6.6 ; also sheet 3,4
D3V3_STM: J1.4(VDD) J3.1 R46.1 R47.1 R51.2 ; also sheet 2,3,4
DGND: J1.6(VSS) J2.5(GND) J3.3 J3.5 J4.2 J5.2 J5.3 J6.1 J6.2 J6.9 J6.10 J6.15 J6.16 U15.2(GND) ; also sheet 2,3,4
I2C1_SCL: J6.26 ; also sheet 4
I2C1_SDA: J6.28 ; also sheet 4
JNTRST: J3.10
JTDI: J3.8
N$2: R50.1 U15.3(IO2)
N$4: R49.1 U15.1(IO1)
N$7: J6.27 R212.1
N$9: J6.19 R211.1
N$27: J1.1(DAT2) R46.2
N$35: J1.8(DAT1) R47.2
PA9: J6.23 ; also sheet 3
PA10: J6.21 ; also sheet 3
PB5: J6.25 ; also sheet 3
PC14: J6.17 ; also sheet 3
PC15: R211.2 R212.2 ; also sheet 3
SPI1_MISO: J6.22 ; also sheet 3
SPI1_MOSI: J6.20 ; also sheet 3
SPI1_NSS: J6.24 ; also sheet 3,4
SPI1_SCK: J6.18 ; also sheet 3
SPI2_MISO: J1.7(DAT0) ; also sheet 3
SPI2_MOSI: J1.3(CMD) ; also sheet 3
SPI2_NSS: J1.2(CD/DAT3) ; also sheet 3,4
SPI2_SCK: J1.5(CLK) ; also sheet 3
SWCLK: J3.4 ; also sheet 3
SWDIO: J3.2 ; also sheet 3
TRACESWO: J3.6 ; also sheet 3
USBD+: J2.3(D+) U15.4(IO2)
USBD-: J2.2(D-) U15.6(IO1)
USBDM: R49.2 ; also sheet 3
USBDP: R50.2 R51.1 ; also sheet 3
VBAT_I: J4.1 ; also sheet 3
VBUS: J2.1(VBUS) U15.5(VBUS) ; also sheet 2,4
VSUP: J6.3 J6.4 ; also sheet 2,4
WALL: J5.1 ; also sheet 2,4
Unconnected: J2.4(ID) J2.MNT$1(MNT) J2.MNT$2(MNT) J2.MNT$3(MNT) J2.MNT$4(MNT) J2.MNT$5(MNT) J2.MNT$6(MNT) J3.7 J3.9 J4.MNT$1 J4.MNT$2 J6.11 J6.12 J6.13 J6.14 J6.31 J6.32 J6.33 J6.34 J6.37 J6.38 J6.39 J6.40 J6.43 J6.44 J6.45 J6.46 J6.49 J6.50 J6.51 J6.52 J6.55 J6.56 J6.57 J6.58 J6.61 J6.62 J6.63 J6.64 J6.67 J6.68 J6.69 J6.70 J6.73 J6.74 J6.75 J6.76

### Notes on the sheet
- WALL connector
- USART1_RX
- USART1_TX
- MicroSD card connector | I2C1_SMBA
- Battery connector
- USB connector
- Programmer connector
- South bridge

## Power pins joined to a net without a drawn wire
DGND: X1.2(DGND) X1.4(DGND)
EXP: U14.EXP

## Library data of the parts
B1 B2 = powerboard:BEAD: BEAD; DIGI-KEY#: 490-5224-1-ND; MF: Murata; MPN: BLM18SG700TN1D
C1-C3 C6-C22 = powerboard:C: CAPACITOR
C4 C5 = powerboard:C: CAPACITOR; DNP: ON
J1 = powerboard:CON-HRS-DM3AT: Hirose DM3AT microSD card connector Hirose DM3AT Push-Push (ejection mechanism), top board mounting microSD card connector Source: http://www.hirose.co.jp/cataloge_hp/e60900232.pdf; DIGI-KEY#: HR1964CT-ND; MF: Hirose; MPN: DM3AT-SF-PEJM5; TERMINATION-TYPE: Right-angle SMT (standard)
J2 = powerboard:CON-ZX62R-B-5P: ZX62R-B-5P Hirose ZX Series Micro-B USB receptacle (right angle, top mount, SMT) Source: http://www.hirose.co.jp/cataloge_hp/e24200011.pdf http://media.digikey.com/PDF/Data%20Sheets/Hirose%20PDFs/ZX62R-B-5P.pdf; DIGI-KEY#: H11574CT-ND; MF: Hirose; MPN: ZX62R-B-5P; TEMINATION-TYPE: Right-angle SMT, Horizontal
J3 = powerboard:CON-FTSH-105-01-L-DV-K: FTSH Header Samtec FTSH series 2 x 5 pin SMT micro header Source: http://www.samtec.com/ftppub/pdf/ftsh_mt.pdf; DIGI-KEY#: FTSH-105-01-L-DV-K-ND; MF: Samtec; MPN: FTSH-105-01-L-DV-K
J4 = powerboard:CON-S2B-PH-SM4-TB: JST connector (vertical) 2-pin vertical JST connector with SMT Source: http://www.jst-mfg.com/product/pdf/eng/ePH.pdf; CONNECTOR-TYPE: Header, shrouded; CONTACT-TYPE: Male pin; DIGI-KEY#: 455-1749-1-ND; MF: JST; MPN: S2B-PH-SM4-TB(LF)(SN)
J5 = powerboard:CON-PJ-102A: PJ-102A CUI Inc. 2.0mm center pin diameter, 6.0mm outer hole diameter SMT power jack w/o shield Source: http://products.cui.com/getPDF.aspx?fileID=6027; DIGI-KEY#: CP-102A-ND; MF: CUI; MPN: PJ-102A
J6 = powerboard:CON-71741: Board-to-Board Connector 1.00mm (.039") Pitch Mezzanine Plug, Surface Mount, Dual Row, Vertical Stacking, 84 Circuits, 8.35mm (.329") Unmated Height, with PCB Locator Pegs, with Robotic Placement Metal Cap, 0.25µm (10µ") Gold (Au) Selective Plating, Embossed Tape on R Source: http://www.molex.com/molex/products/datasheet.jsp?part=active/0717410002_PCB_HEADERS.xml
J7 = powerboard:SWITCH-CJS-1200: CJS-1200 SPDT Switch Source: http://media.digikey.com/pdf/Data%20Sheets/COPAL%20Electronics%20PDFs/CJS.pdf
L1 = powerboard:L: INDUCTOR; CURRENT: 1.7A; DC-RESISTANCE: 51mOhm; DIGI-KEY#: 445-3171-1-ND; L: 1.6uH; MF: TDK; MPN: VLCF4018T-1R6N1R7-2; TOLERANCE: 30%
LED1 = powerboard:LED: LED; COLOR: Green; MF: Kingbright; MPN: APECVA3010MGC
LED2 = powerboard:LED: LED; COLOR: Orange; MF: Kingbright; MPN: APECVA3010SECK
LOGO1 = Logo:LOGO-ISIS-600MIL: ISIS Logo Official logo of the Institute for Software Integrated Systems (ISIS), Vanderbilt as of 2011 Generated from 360 x 360 px bitmap and scaled to 600 x 600 mil v1.0 Initial design
LOGO2 = Logo:LOGO-BATTERY-600MIL: Power Supply Board Logo Preliminary logo for the Marmote platform power supply module Generated from 360 x 360 px bitmap and scaled to 600 x 600 mil v1.1 Source bitmap smoothened v1.0 Initial design
LOGO5 = Logo:LOGO-VANDERBILT-600MIL: Vanderbilt Logo Official Framed Vanderbilt Logo Generated from 360 x 360 px bitmap and scaled to 600 x 600 mil v1.1 Source bitmap smoothened v1.0 Initial design
LOGO6 = Logo:LOGO-MARMOTE-600MIL: Marmote Platform Logo Preliminary logo for the Marmote Platform (http://marmote.googlecode.com) Generated from 360 x 360 px bitmap and scaled to 600 x 600 mil v1.1 Source bitmap smoothened v1.0 Initial design
M1-M4 = powerboard:MOUNT-HOLE: MOUNTING HOLE with drill center marker
M5-M8 = powerboard:FIDUCIAL: Fiducial Alignment Points Various fiducial points for machine vision alignment.
Q1 = powerboard:SI2323CDS: Si2323CDS Vishay Siliconix Si2323CDS P-Channel 20 V (D-S) MOSFET Source: http://www.vishay.com/docs/65700/si2323cd.pdf; DIGI-KEY#: SI2323CDS-T1-GE3CT-ND; MF: Vishay; MPN: SI2323CDS-T1-GE3
Q2 = powerboard:SI2312CDS: Si2312CDS Vishay Siliconix Si2312CDS N-Channel 20 V (D-S) MOSFET Source: http://www.vishay.com/docs/65900/si2312cd.pdf; DIGI-KEY#: SI2312CDS-T1-GE3CT-ND; MF: Vishay; MPN: SI2312CDS-T1-GE3
Q3 Q4 = powerboard:SI2333CDS: Si2333CDS Vishay Siliconix Si2333CDS P-Channel 12 V (D-S) MOSFET Source: http://www.vishay.com/docs/68717/si2333cd.pdf; DIGI-KEY#: SI2333CDS-T1-GE3CT-ND; MF: Vishay; MPN: SI2333CDS-T1-GE3
R1 R6-R8 R16-R20 R151 R152 = powerboard:R: RESISTOR; TOLERANCE: 1%
R4 R10-R14 R22-R51 R211 R212 R451-R453 = powerboard:R: RESISTOR
R9 = powerboard:NTCG: NTC; DIGI-KEY#: 541-1107-1-ND; MF: Vishay/Dale; MPN: 541-1107-1-ND; NTC: ON; PN: NTHS0603N02N1002JE; RESISTANCE: 10k; TOLERANCE: 1%
SW1 = powerboard:SWITCH-SPST: SPST Switch General Single-Pole Single-Throw (SPST) switch; DIGI-KEY#: 455-1749-1-ND; MF: JST; MPN: S2B-PH-SM4-TB(LF)(SN)
SW2 = powerboard:SWITCH-MS12ASG30: MS12ASx30 NKK Right-Angle PCB Mount SPDT Slide Switch with Bracket Mount Source: http://www.nkkswitches.com/pdf/MSnonilluminated.pdf; DIGI-KEY#: 360-2390-ND; MF: NKK; MPN: MS12ASG30
SW3 = powerboard:SWITCH-ESWITCH-TL3340: E-Switch TL3340 series momentary switch Source: http://www.e-switch.com/Portals/0/Series_Pdf/TL3340.pdf
TP1 TP2 TP11 = powerboard:TESTPOINT: Test Point Keystone compact through hole mount test point for SUPPLY and GROUND signals Terminal: .015 (.38) × .032 (.81) thick Phosphor Bronze Wire, Silver Plate Base: Nylon 46, UL Rated 94V-0 Mtg. Hole: .063 (1.6) Diameter Source: http://www.keyelco.com/pdfs/M55p51.pdf; DIGI-KEY#: 5009K-ND; MF: Keystone; MPN: 5009
TP3-TP6 TP9 TP10 TP12 TP14 = powerboard:TESTPOINT: Test Point Keystone compact through hole mount test point for SUPPLY and GROUND signals Terminal: .015 (.38) × .032 (.81) thick Phosphor Bronze Wire, Silver Plate Base: Nylon 46, UL Rated 94V-0 Mtg. Hole: .063 (1.6) Diameter Source: http://www.keyelco.com/pdfs/M55p51.pdf; DIGI-KEY#: 5122K-ND; MF: Keystone; MPN: 5122
TP7 TP8 = powerboard:TESTPOINT: Test Point Keystone compact through hole mount test point for SUPPLY and GROUND signals Terminal: .015 (.38) × .032 (.81) thick Phosphor Bronze Wire, Silver Plate Base: Nylon 46, UL Rated 94V-0 Mtg. Hole: .063 (1.6) Diameter Source: http://www.keyelco.com/pdfs/M55p51.pdf; DIGI-KEY#: 5121K-ND; MF: Keystone; MPN: 5121
TP13 = powerboard:TESTPOINT: Test Point Keystone compact through hole mount test point for SUPPLY and GROUND signals Terminal: .015 (.38) × .032 (.81) thick Phosphor Bronze Wire, Silver Plate Base: Nylon 46, UL Rated 94V-0 Mtg. Hole: .063 (1.6) Diameter Source: http://www.keyelco.com/pdfs/M55p51.pdf; DIGI-KEY#: 5005K-ND; MF: Keystone; MPN: 5005
U1 = powerboard:LTC4361: LTC4361-1/2 Overvoltage/Overcurrent Protection Controller Note: After an overcurrent fault, the LTC4361-1 remains off while the LTC4361-2 automatically restarts after a 130ms start-up delay. Source: http://cds.linear.com/docs/Datasheet/436112fa.pdf; DIGI-KEY#: LTC4361IDC-2#TRMPBFCT-ND; MF: Linear Technology; MPN: LTC4361IDC-2#TRMPBF
U2 = powerboard:LTC4085: LTC4085 USB Power Manager with Ideal Diode Controller and Li-Ion Charger Note: LTC4085 has a preset charge voltage of 4.2V, whereas LTC4085-1 has that of 4.1V. Source: http://cds.linear.com/docs/Datasheet/4085fd.pdf; DIGI-KEY#: LTC4085EDE#PBF-ND; MF: Linear Technology; MPN: LTC4085EDE#PBF
U3 U4 = powerboard:XC6220: XC6220 Torex 1A LDO Voltage Regulator with "GreenOperation" Source: http://www.torex.co.jp/english/products/pro02/pdf/60-50-XC6220.pdf; DIGI-KEY#: 893-1133-1-ND; MF: Torex; MPN: XC6220B331MR-G
U5 = powerboard:XC9236: XC9236 Torex XC9236 600mA Driver Transistor Built-In, Synchronous Step-Down DC/DC Converter with automatic PWM/PFM switching control. Source: http://www.torex.co.jp/english/products/pro03/pdf032/21-XC9235~37.pdf; DIGI-KEY#: 893-1120-1-ND; MF: Torex; MPN: XC9236A15DMR-G; SW-FREQ: 3MHz; VOUT: 1.5V
U6 = powerboard:MIC9404: Micrel 94040/1/2/3 28 mΩ RDSON 3A High Side Load Siwth in 1.2mm x .12mm MLF package Source: http://www.micrel.com/_PDF/mic9404x.pdf; DIGI-KEY#: 576-3228-1-ND; MF: Micrel; MPN: MIC94043YFL TR
U8-U12 = powerboard:MAX9938: MAX9938 Maxim 1μA, 4-Bump UCSP/SOT23, Precision Current-Sense Amplifier Source: http://datasheets.maxim-ic.com/en/ds/MAX9938.pdf; DIGI-KEY#: MAX9938FEUK+TCT-ND; MF: Maxim; MPN: MAX9938FEUK+T
U13 = powerboard:STM32F10XCXT6: STM32F10X STMicroelectronics STM32F101/102/103 32-bit ARM Cortex based MCUs in 48-pin LQFP package Source: http://www.st.com/internet/com/TECHNICAL_RESOURCES/TECHNICAL_LITERATURE/DATASHEET/CD00210831.pdf; DIGI-KEY#: 497-8308-ND; MF: STMicroelectronics; MPN: STM32F102CBT6
U14 = powerboard:LTC2942: LTC2942-1/2 Linear Technology Battery Gas Gauge with Temperature, Voltage Measurement, 6-pin DFN 2x3mm Note: LTC2942 requires an external sense resistor, while LTC2942-1 features a 50 mΩ integrated sense resistor Source: http://cds.linear.com/docs/Datasheet/29421f.pdf http://cds.linear.com/docs/Datasheet/2942fa.pdf; DIGI-KEY#: LTC2942CDCB-1#TRMPBFCT-ND; MF: Linear Technology; MPN: LTC2942CDCB-1#TRMPBF
U15 = powerboard:USBLC6-2: USBLC6-2 Very low capacitance ESD protection Source: http://www.st.com/internet/com/TECHNICAL_RESOURCES/TECHNICAL_LITERATURE/DATASHEET/CD00050750.pdf; DIGI-KEY#: 497-5235-1-ND; MF: STMicroelectronics; MPN: USBLC6-2SC6
X1 = powerboard:ECX-2236: ECX-2236 Compact SMD crystal in 2.5 x 2.0 x 0.55 mm ceramic package Source: http://www.ecsxtal.com/store/pdf/ECX-2236.pdf Note: Device has two GND pins named DGND; CLOAD: 8pF; DIGI-KEY#: XC1552CT-ND; FREQ: 16MHz; MF: ECS; MPN: ECS-160-8-36CKM
X2 = powerboard:ECX-31B: ECX-31B ECS Inc. ultra-miniature compact SMD tuning fork crystal in 3.2 x 1.5 x 0.9 mm ceramic package Source: http://www.ecsxtal.com/store/pdf/ecx-31b.pdf; CLOAD: 7pF; DIGI-KEY#: XC1656CT-ND; DNP: ON; FREQ: 32.7kHz; MF: ECS; MPN: ECS-.327-7-34B-TR